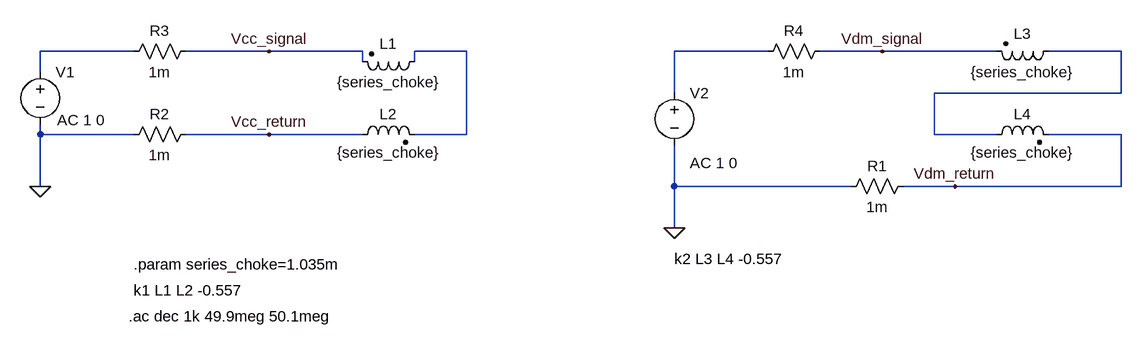
[diagram p0: schematic hw2_p4b_eantunano.asc]
hw2_p4b_eantunano.asc, the LTspice schematic file:
Version 4
SHEET 1 1524 680
WIRE -64 -32 -208 -32
WIRE 144 -32 16 -32
WIRE 288 -32 144 -32
WIRE 448 -32 368 -32
WIRE 912 -32 768 -32
WIRE 1088 -32 992 -32
WIRE 1264 -32 1088 -32
WIRE 1456 -32 1344 -32
WIRE 288 -16 288 -32
WIRE 368 -16 368 -32
WIRE -208 0 -208 -32
WIRE 768 32 768 -32
WIRE 1456 32 1456 -32
WIRE 1456 32 1168 32
WIRE -208 96 -208 80
WIRE -64 96 -208 96
WIRE 144 96 16 96
WIRE 288 96 144 96
WIRE 448 96 448 -32
WIRE 448 96 368 96
WIRE 1168 96 1168 32
WIRE 1264 96 1168 96
WIRE 1456 96 1344 96
WIRE -208 176 -208 96
WIRE 768 176 768 112
WIRE 1040 176 768 176
WIRE 1200 176 1120 176
WIRE 1456 176 1456 96
WIRE 1456 176 1200 176
WIRE 768 240 768 176
FLAG -208 176 0
FLAG 768 240 0
FLAG 144 -32 Vcc_signal
FLAG 144 96 Vcc_return
FLAG 1088 -32 Vdm_signal
FLAG 1200 176 Vdm_return
SYMBOL ind2 384 -32 R90
WINDOW 0 4 56 VBottom 2
WINDOW 3 32 56 VTop 2
SYMATTR InstName L1
SYMATTR Value {series_choke}
SYMATTR Type ind
SYMBOL ind2 272 112 R270
WINDOW 0 32 56 VTop 2
WINDOW 3 4 56 VBottom 2
SYMATTR InstName L2
SYMATTR Value {series_choke}
SYMATTR Type ind
SYMBOL res 32 80 R90
WINDOW 0 0 56 VBottom 2
WINDOW 3 32 56 VTop 2
SYMATTR InstName R2
SYMATTR Value 1m
SYMBOL res 32 -48 R90
WINDOW 0 0 56 VBottom 2
WINDOW 3 32 56 VTop 2
SYMATTR InstName R3
SYMATTR Value 1m
SYMBOL voltage -208 -16 R0
WINDOW 123 26 90 Left 2
WINDOW 39 0 0 Left 0
SYMATTR InstName V1
SYMATTR Value ""
SYMATTR Value2 AC 1 0
SYMBOL ind2 1360 -48 R90
WINDOW 0 4 56 VBottom 2
WINDOW 3 32 56 VTop 2
SYMATTR InstName L3
SYMATTR Value {series_choke}
SYMATTR Type ind
SYMBOL ind2 1248 112 R270
WINDOW 0 32 56 VTop 2
WINDOW 3 4 56 VBottom 2
SYMATTR InstName L4
SYMATTR Value {series_choke}
SYMATTR Type ind
SYMBOL res 1136 160 R90
WINDOW 0 0 56 VBottom 2
WINDOW 3 32 56 VTop 2
SYMATTR InstName R1
SYMATTR Value 1m
SYMBOL res 1008 -48 R90
WINDOW 0 0 56 VBottom 2
WINDOW 3 32 56 VTop 2
SYMATTR InstName R4
SYMATTR Value 1m
SYMBOL voltage 768 16 R0
WINDOW 123 24 124 Left 2
WINDOW 39 0 0 Left 0
SYMATTR InstName V2
SYMATTR Value ""
SYMATTR Value2 AC 1 0
TEXT -64 336 Left 2 !k1 L1 L2 -0.557
TEXT -72 376 Left 2 !.ac dec 1k 49.9meg 50.1meg
TEXT -64 296 Left 2 !.param series_choke=1.035m
TEXT 768 288 Left 2 !k2 L3 L4 -0.557

The netlist it stands for:
* hw2_p4b_eantunano.asc
L1 N002 Vcc_signal {series_choke}
L2 Vcc_return N002 {series_choke}
R2 Vcc_return 0 1m
R3 Vcc_signal N001 1m
V1 N001 0 AC 1 0
L3 N004 Vdm_signal {series_choke}
L4 N004 Vdm_return {series_choke}
R1 Vdm_return 0 1m
R4 Vdm_signal N003 1m
V2 N003 0 AC 1 0
k1 L1 L2 -0.557
.ac dec 1k 49.9meg 50.1meg
.param series_choke=1.035m
k2 L3 L4 -0.557
.backanno
.end